# EAGLE design multisonar (EAGLE 8.3.0)
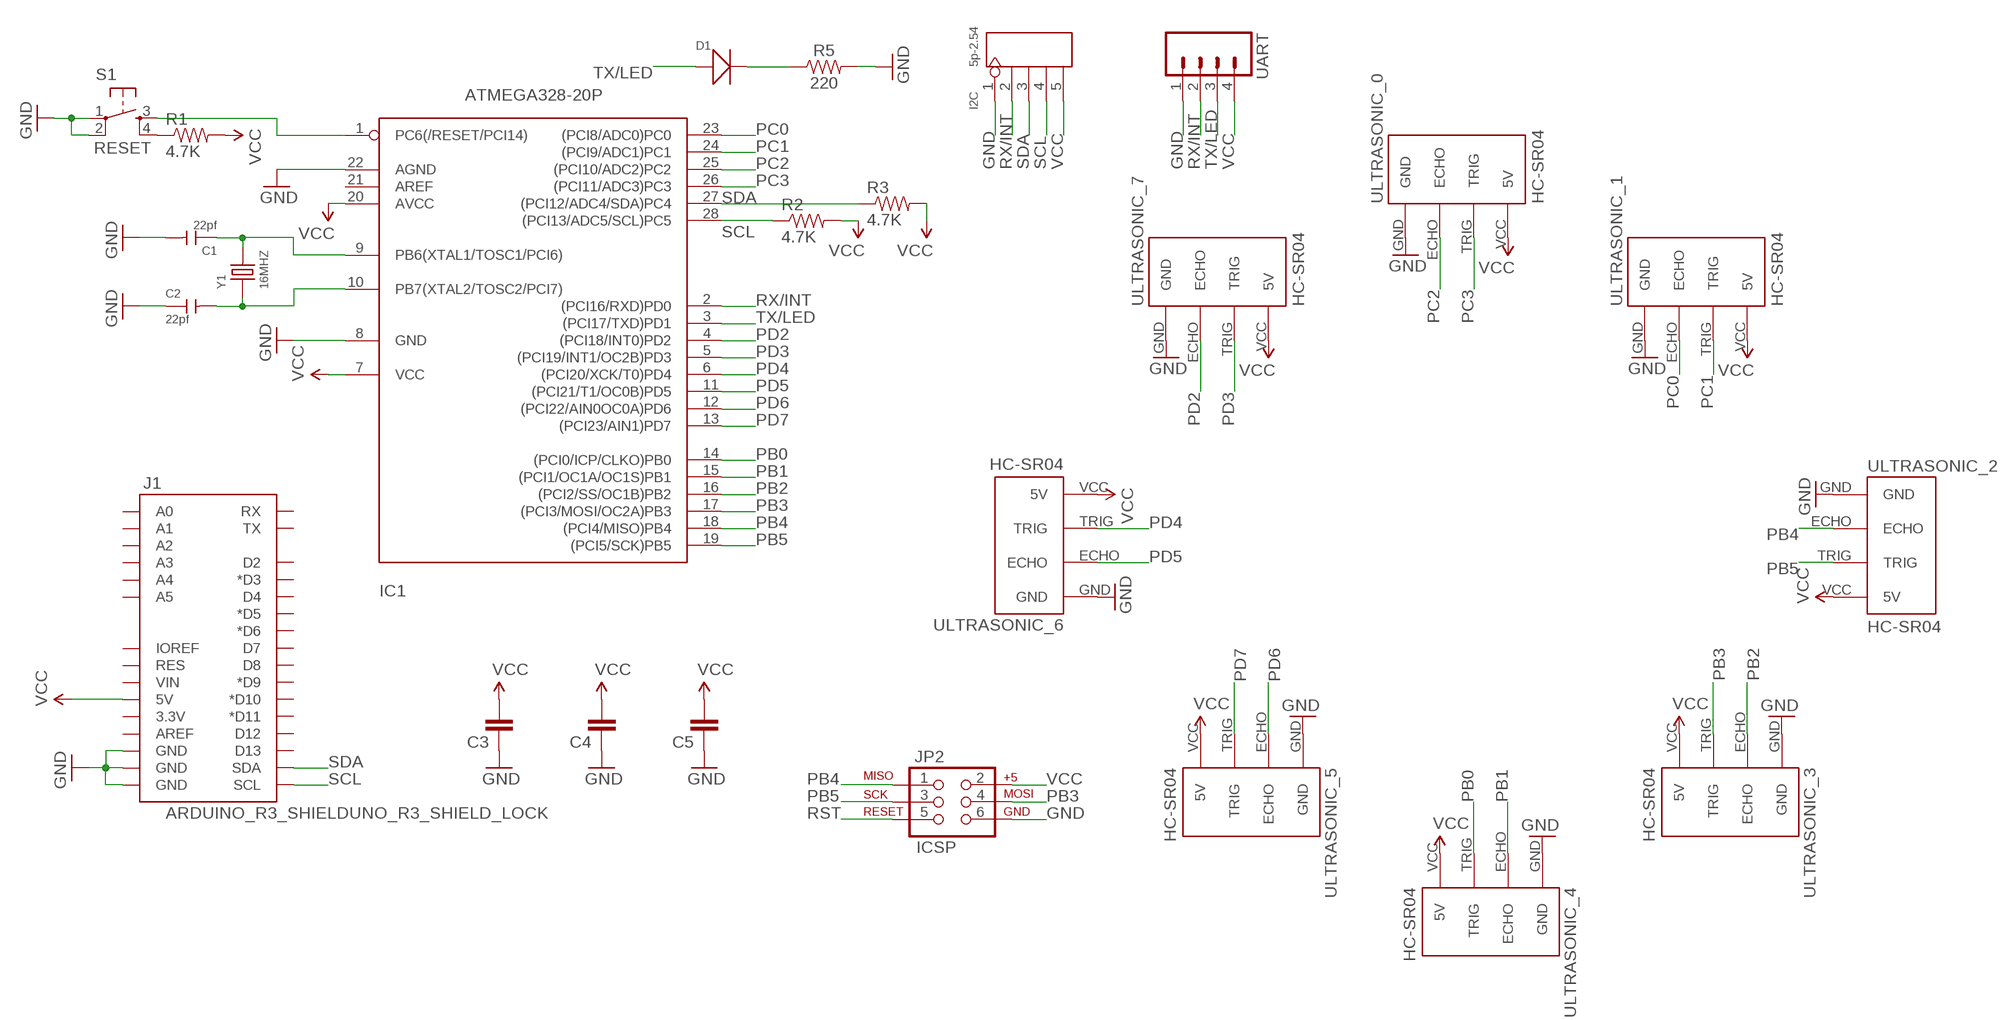
[diagram p0: schematic, sheet 1]

## Parts
C1  22pf  DIP-CERAMIC-22PF-100V-5%-NPO(D5.0MM)  [CERAMIC-2.54]
C2  22pf  DIP-CERAMIC-22PF-100V-5%-NPO(D5.0MM)  [CERAMIC-2.54]
C3  0.1UF-50V-20%(PTH)KIT-EZ  [CAP-PTH-SMALL-KIT]
C4  0.1UF-50V-20%(PTH)KIT-EZ  [CAP-PTH-SMALL-KIT]
C5  0.1UF-50V-20%(PTH)KIT-EZ  [CAP-PTH-SMALL-KIT]
D1  DIODE'1206'  [SOD-123]
I2C  5p-2.54  DIP-BLACK-FEMALE-HEADER-VERT(5P-2.54)  [H5-2.54]
IC1  ATMEGA328-20P  [DIL28-3]
J1  ARDUINO_R3_SHIELDUNO_R3_SHIELD_LOCK  [UNO_R3_SHIELD_LOCK]
JP2  ICSP  AVR_SPI_PRG_62X3_LOCK  [2X3_LOCK]
R1  4.7K  10KOHM-1/4W-1%(PTH)HORIZ-KIT  [AXIAL-0.3EZ]
R2  4.7K  10KOHM-1/4W-1%(PTH)HORIZ-KIT  [AXIAL-0.3EZ]
R3  4.7K  10KOHM-1/4W-1%(PTH)HORIZ-KIT  [AXIAL-0.3EZ]
R5  220  RESISTOR1206  [1206]
S1  RESET  TACTILE-SWITCH-PTH  [TAC-SWITCH-PTH]
UART  M04PTH  [1X04]
ULTRASONIC_0  HC-SR04  [HC-SR04_FOOTPRINT]
ULTRASONIC_1  HC-SR04  [HC-SR04_FOOTPRINT]
ULTRASONIC_2  HC-SR04  [HC-SR04_FOOTPRINT]
ULTRASONIC_3  HC-SR04  [HC-SR04_FOOTPRINT]
ULTRASONIC_4  HC-SR04  [HC-SR04_FOOTPRINT]
ULTRASONIC_5  HC-SR04  [HC-SR04_FOOTPRINT]
ULTRASONIC_6  HC-SR04  [HC-SR04_FOOTPRINT]
ULTRASONIC_7  HC-SR04  [HC-SR04_FOOTPRINT]
Y1  16MHZ  DIP-CRYSTAL-16MHZ-18PF-30PPM-40R(HC49US)  [HC49US]

## Nets
GND: C1.2 C2.1 C3.1 C4.1 C5.1 I2C.1 IC1.8(GND) IC1.22(AGND) J1.GND@0(GND) J1.GND@1(GND) J1.GND@2(GND) JP2.6 R5.2 S1.1 S1.2 UART.1 ULTRASONIC_0.GND ULTRASONIC_1.GND ULTRASONIC_2.GND ULTRASONIC_3.GND ULTRASONIC_4.GND ULTRASONIC_5.GND ULTRASONIC_6.GND ULTRASONIC_7.GND
N$1: R1.P$1 S1.4
N$2: D1.- R5.1
N$3: C1.1 IC1.9(PB6(XTAL1/TOSC1/PCI6)) Y1.2
N$4: C2.2 IC1.10(PB7(XTAL2/TOSC2/PCI7)) Y1.1
PB0: IC1.14((PCI0/ICP/CLKO)PB0) ULTRASONIC_4.TRIG
PB1: IC1.15((PCI1/OC1A/OC1S)PB1) ULTRASONIC_4.ECHO
PB2: IC1.16((PCI2/SS/OC1B)PB2) ULTRASONIC_3.ECHO
PB3: IC1.17((PCI3/MOSI/OC2A)PB3) JP2.4 ULTRASONIC_3.TRIG
PB4: IC1.18((PCI4/MISO)PB4) JP2.1 ULTRASONIC_2.ECHO
PB5: IC1.19((PCI5/SCK)PB5) JP2.3 ULTRASONIC_2.TRIG
PC0: IC1.23((PCI8/ADC0)PC0) ULTRASONIC_1.ECHO
PC1: IC1.24((PCI9/ADC1)PC1) ULTRASONIC_1.TRIG
PC2: IC1.25((PCI10/ADC2)PC2) ULTRASONIC_0.ECHO
PC3: IC1.26((PCI11/ADC3)PC3) ULTRASONIC_0.TRIG
PD2: IC1.4((PCI18/INT0)PD2) ULTRASONIC_7.ECHO
PD3: IC1.5((PCI19/INT1/OC2B)PD3) ULTRASONIC_7.TRIG
PD4: IC1.6((PCI20/XCK/T0)PD4) ULTRASONIC_6.TRIG
PD5: IC1.11((PCI21/T1/OC0B)PD5) ULTRASONIC_6.ECHO
PD6: IC1.12((PCI22/AIN0OC0A)PD6) ULTRASONIC_5.ECHO
PD7: IC1.13((PCI23/AIN1)PD7) ULTRASONIC_5.TRIG
RST: IC1.1(PC6(/RESET/PCI14)) JP2.5 S1.3
RX/INT: I2C.2 IC1.2((PCI16/RXD)PD0) UART.2
SCL: I2C.4 IC1.28((PCI13/ADC5/SCL)PC5) J1.SCL R2.P$1
SDA: I2C.3 IC1.27((PCI12/ADC4/SDA)PC4) J1.SDA R3.P$1
TX/LED: D1.+ IC1.3((PCI17/TXD)PD1) UART.3
VCC: C3.2 C4.2 C5.2 I2C.5 IC1.7(VCC) IC1.20(AVCC) J1.5V JP2.2 R1.P$2 R2.P$2 R3.P$2 UART.4 ULTRASONIC_0.VCC(5V) ULTRASONIC_1.VCC(5V) ULTRASONIC_2.VCC(5V) ULTRASONIC_3.VCC(5V) ULTRASONIC_4.VCC(5V) ULTRASONIC_5.VCC(5V) ULTRASONIC_6.VCC(5V) ULTRASONIC_7.VCC(5V)
Unconnected: IC1.21(AREF) J1.3.3V J1.A0 J1.A1 J1.A2 J1.A3 J1.A4 J1.A5 J1.AREF J1.D2 J1.D3(*D3) J1.D4 J1.D5(*D5) J1.D6(*D6) J1.D7 J1.D8 J1.D9(*D9) J1.D10(*D10) J1.D11(*D11) J1.D12 J1.D13 J1.IOREF J1.RES J1.RX J1.TX J1.VIN

## Library data of the parts
C1 C2 = Seeed-OPL-Capacitor:DIP-CERAMIC-22PF-100V-5%-NPO(D5.0MM): 302010197; MPN: CT4-0805CG220J101F3
C3-C5 = SparkFun-Capacitors:0.1UF-50V-20%(PTH): CAP-08370; PROD_ID: CAP-08370
D1 = Seeed-OPL-Diode:DIODE*
I2C = Seeed-OPL-Connector:DIP-BLACK-FEMALE-HEADER-VERT(5P-2.54): 320030028; MPN: F185-1105A0BSYA1
IC1 = atmega328:ATMEGA328*P: MICROCONTROLLER 32 kBytes FLASH 2 kBytes SRAM 1 kBytes EEPROM USART 8-channel 10 bit ADC
J1 = SparkFun-Boards:ARDUINO_R3_SHIELD: Shield form compatible with the Arduino Uno R3.
JP2 = SparkFun-Connectors:AVR_SPI_PRG_6: AVR ISP 6 Pin This is the reduced ISP connector for AVR programming. Common on Arduino. This footprint will take up less PCB space and can be used with a 10-pin to 6-pin adapter such as SKU: BOB-08508 **Special note about "TEST_POINT" package. The stop mask is on the top side, so if you want your programming test points to be on the bottom of your board, make sure to place this package on the bottom side of the board. This also ensure that the orientation to program from the bottom side will be correct.
R1-R3 = SparkFun-Resistors:10KOHM-1/4W-1%(PTH): RES-12183; PROD_ID: RES-12183; VALUE: 10k
R5 = SparkFun-Resistors:RESISTOR: Generic Resistor Package
S1 = GeekAmmo:TACTILE-SWITCH: Tactile Switch 4 Pins, SPST NO
UART = SparkFun-Connectors:M04: Header 4 Standard 4-pin 0.1" header. Use with straight break away headers (SKU : PRT-00116), right angle break away headers (PRT-00553), swiss pins (PRT-00743), machine pins (PRT-00117), and female headers (PRT-00115). Molex polarized connector foot print use with SKU : PRT-08231 with associated crimp pins and housings. 1MM SMD Version SKU: PRT-10208
ULTRASONIC_0 ULTRASONIC_1-ULTRASONIC_7 = Ultrasonic Sensor HC-SR04:HC-SR04: Ultrasonic Sensor HC-SR04
Y1 = Seeed-OPL-Crystal-Oscillator:DIP-CRYSTAL-16MHZ-18PF-30PPM-40R(HC49US): 306010014; MPN: HC-49US 16.000MHz

## Board
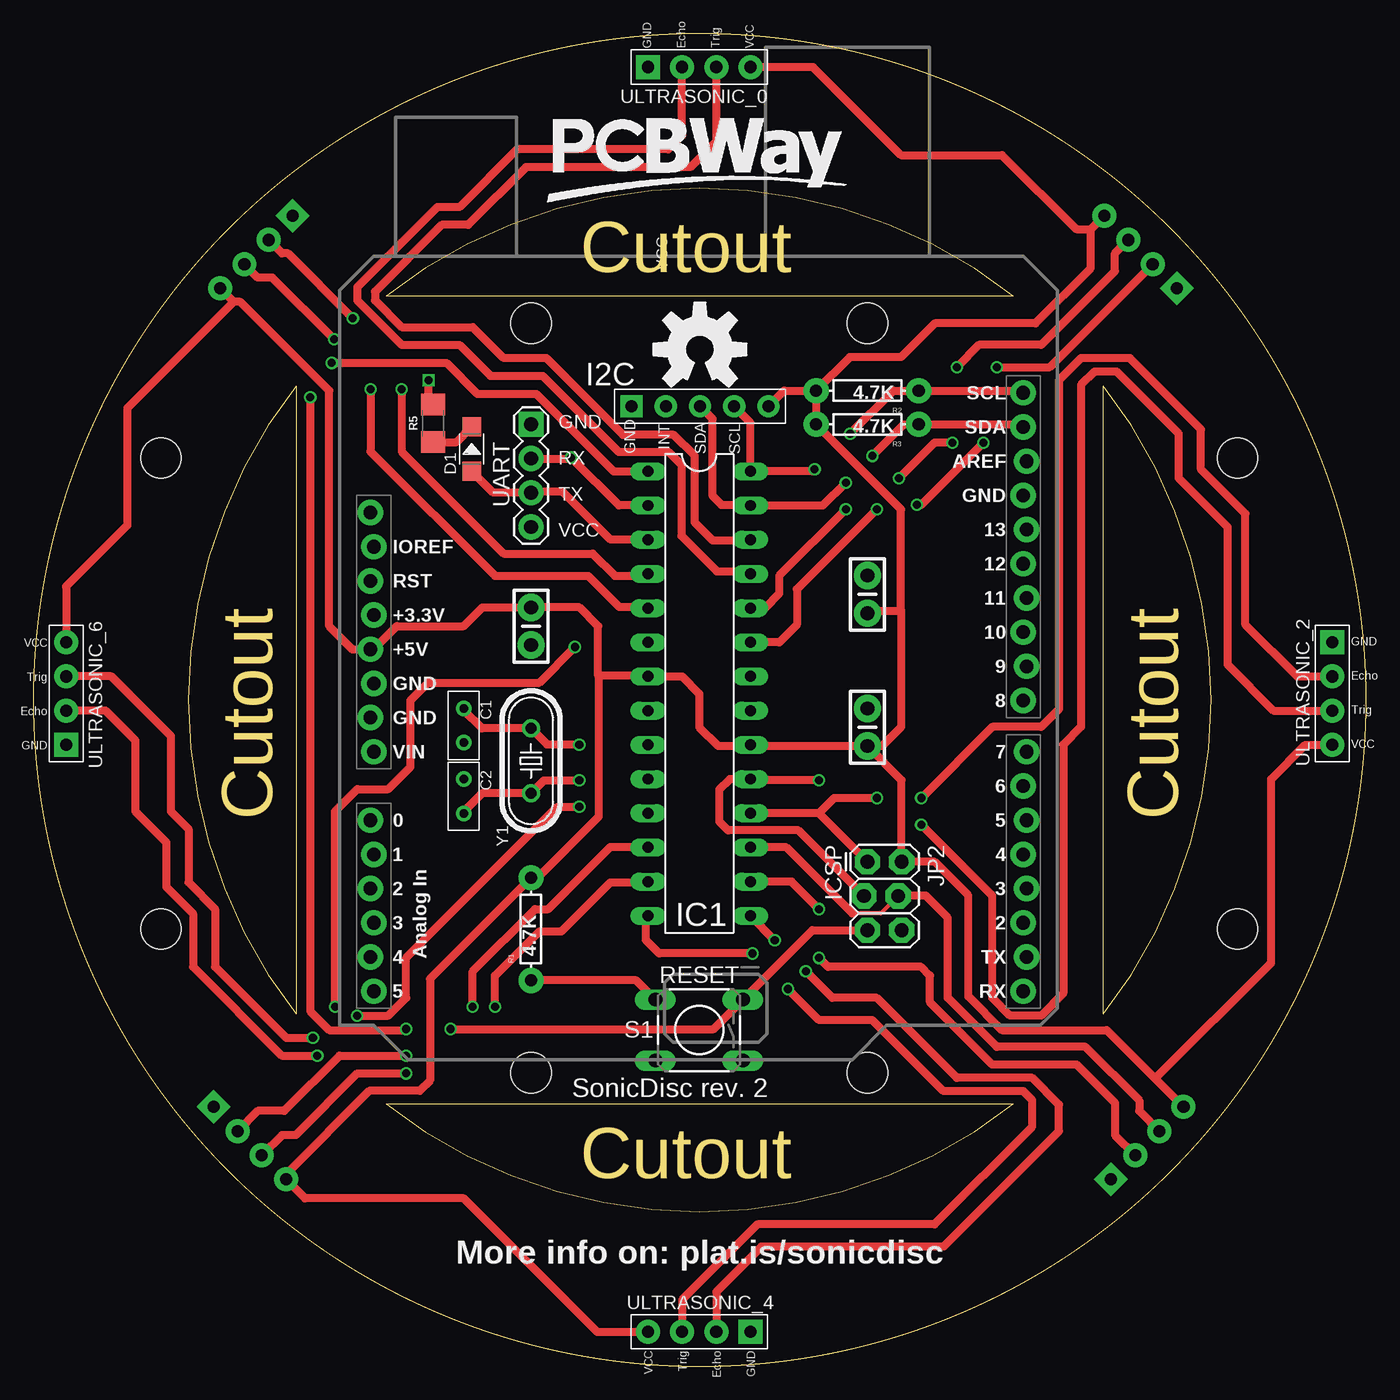
[diagram p1: board, top side]
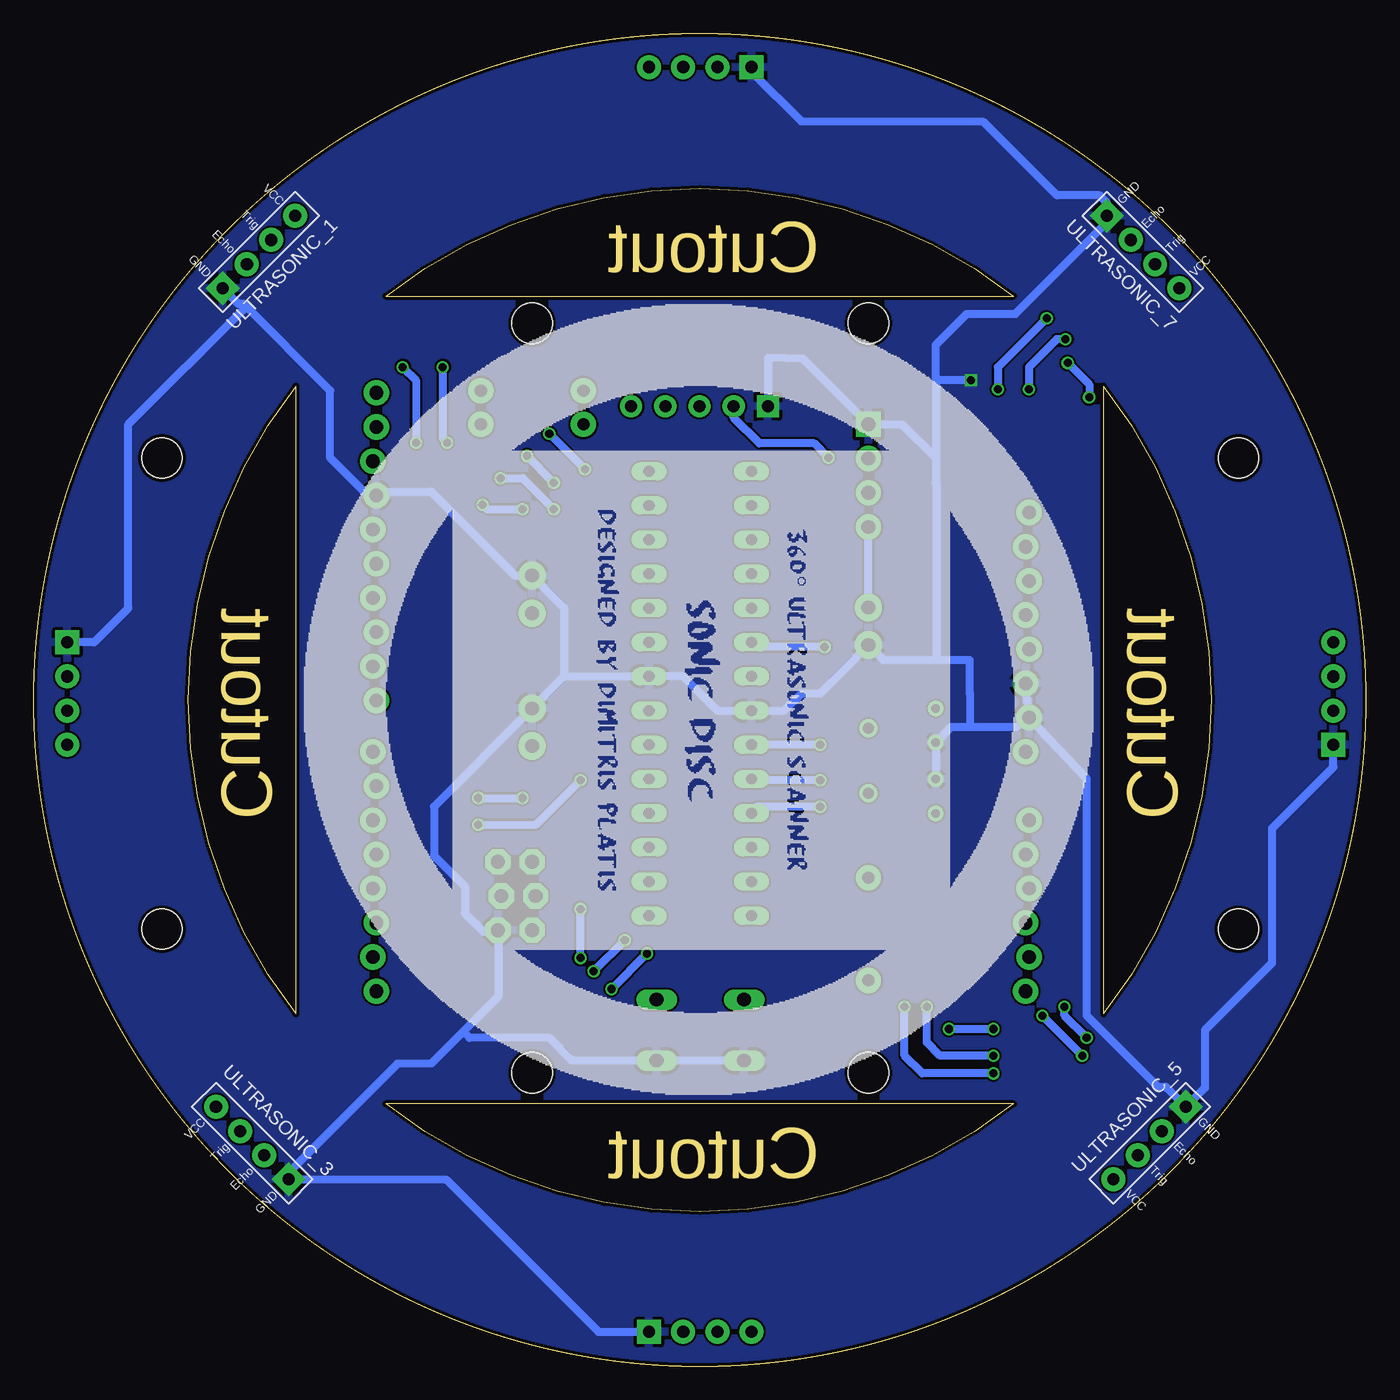
[diagram p2: board, bottom side, seen from below]

Size 99 x 99 mm. Coordinates in mm from the lower left corner, seen from the top.
Outline: 19.5,72.82 arc76 19.5,26.18 19.5,72.82
Outline: 26.18,19.5 72.82,19.5 arc-76 26.18,19.5
Outline: 79.5,26.18 79.5,72.82 arc-76 79.5,26.18
Outline: 72.82,79.5 arc76 26.18,79.5 72.82,79.5
Outline: circle at 49.5,49.5 radius 49.5
Copper layers (1*16): Top 0.035mm / dielectric 1.5mm / Bottom 0.035mm
Design rules "SeeedStudio_2layer_DRU_edited": minimum track width 7mil, minimum drill 15mil, track to track 6mil, track to pad 6mil, pad to pad 6mil, via to via 6mil, smd to smd 0mil, copper to edge 10mil, drill to drill 10mil, minimum pad ring 10mil, minimum via ring 6mil, stop-mask expansion 2mil, vias tented up to drill 100mil, thermal gap 10mil
Holes 3 mm at 36.96,77.48 36.96,21.81 61.96,21.81 61.96,77.48 9.46,32.48 89.46,32.48 89.46,67.48 9.46,67.48
Milling: 8 lines

### Footprints (pad centres in the part's own frame; a part is rotated, then mirrored left to right if it is on the bottom)
CERAMIC-2.54 = drill 0.635 pad 1.143: 1 -1.27,0; 2 1.27,0
CAP-PTH-SMALL-KIT = drill 1.016 pad 2.032: 1 -1.397,0; 2 1.397,0
SOD-123 = smd 1.397 x 1.397: + -1.651,0; - 1.651,0
H5-2.54 = drill 0.889 pad 1.651 square: 1 0,5.08 | drill 0.889 pad 1.651: 2 0,2.54; 3 0,0; 4 0,-2.54; 5 0,-5.08
DIL28-3 = drill 0.813 long: 1 -16.51,-3.81; 2 -13.97,-3.81; 3 -11.43,-3.81; 4 -8.89,-3.81; 5 -6.35,-3.81; 6 -3.81,-3.81; 7 -1.27,-3.81; 8 1.27,-3.81; 9 3.81,-3.81; 10 6.35,-3.81; 11 8.89,-3.81; 12 11.43,-3.81; 13 13.97,-3.81; 14 16.51,-3.81; 15 16.51,3.81; 16 13.97,3.81; 17 11.43,3.81; 18 8.89,3.81; 19 6.35,3.81; 20 3.81,3.81; 21 1.27,3.81; 22 -1.27,3.81; 23 -3.81,3.81; 24 -6.35,3.81; 25 -8.89,3.81; 26 -11.43,3.81; 27 -13.97,3.81; 28 -16.51,3.81
UNO_R3_SHIELD_LOCK = drill 1.016 pad 1.88: 3.3V 50.8,26.67; 5V 51.054,29.21; A0 51.054,41.91; A1 50.8,44.45; A2 51.054,46.99; A3 50.8,49.53; A4 51.054,52.07; A5 50.8,54.61; AREF 2.286,15.24; D2 2.54,49.53; D3 2.286,46.99; D4 2.54,44.45; D5 2.286,41.91; D6 2.54,39.37; D7 2.286,36.83; D8 2.54,33.02; D9 2.286,30.48; D10 2.54,27.94; D11 2.286,25.4; D12 2.54,22.86; D13 2.286,20.32; GND@0 50.8,31.75; GND@1 51.054,34.29; GND@2 2.54,17.78; IOREF 50.8,21.59; NC 51.054,19.05; RES 51.054,24.13; RX 2.54,54.61; SCL 2.54,10.16; SDA 2.54,12.7; TX 2.286,52.07; VIN 50.8,36.83
2X3_LOCK = drill 1.016 pad 1.88 octagon: 1 0,0; 2 0,2.54; 3 2.54,-0.254; 4 2.54,2.286; 5 5.08,0; 6 5.08,2.54
AXIAL-0.3EZ = drill 0.9 pad 1.88: P$1 -3.81,0; P$2 3.81,0
1206 = smd 1.6 x 1.8: 1 -1.4,0; 2 1.4,0
TAC-SWITCH-PTH = drill 1.016 pad 1.524 long: 1 -3.251,2.261; 2 3.251,2.261; 3 -3.251,-2.261; 4 3.251,-2.261
1X04 = drill 1.016 pad 1.88 square: 1 0,0 | drill 1.016 pad 1.88: 2 2.54,0; 3 5.08,0; 4 7.62,0
HC-SR04_FOOTPRINT = drill 0.9 pad 1.778: ECHO 2.54,1.27; TRIG 2.54,-1.27; VCC 2.54,-3.81 | drill 0.9 pad 1.778 square: GND 2.54,3.81
HC49US = drill 0.813: 1 -2.413,0; 2 2.413,0

### Placement (x,y rotation side)
C1  31.96,47.61 270 top
C2  31.96,42.35 270 top
C3  36.96,54.98 90 top
C4  61.96,47.48 270 top
C5  61.96,57.34 270 top
D1  32.56,68.14 90 top
I2C  49.52,71.32 90 top
IC1  49.46,49.98 270 top
J1  76.08,82.48 180 top
JP2  61.96,37.48 270 top
R1  36.96,32.48 90 top
R2  61.96,72.48 180 top
R3  61.96,69.98 180 top
R5  29.68,70.06 90 top
S1  49.46,24.98 180 top
U$1  [OSHW-LOGO-L]  49.51,75.54 0 top
UART  36.96,69.98 270 top
ULTRASONIC_0  49.46,93.98 90 top
ULTRASONIC_1  80.46,80.98 135 bottom
ULTRASONIC_2  93.96,49.98 0 top
ULTRASONIC_3  80.96,18.38 225 bottom
ULTRASONIC_4  49.46,5.1 270 top
ULTRASONIC_5  17.86,18.38 315 bottom
ULTRASONIC_6  4.96,49.98 180 top
ULTRASONIC_7  18.36,80.98 45 bottom
Y1  36.96,44.98 90 top

### Tracks (layer width: path | path; a pad name or v marks a point on that pad's centre or on a via)
GND  (via drill 0.6)
  Top 0.61: R5.2 29.36,71.78 v29.36,73.26
  Bottom 0.61: 67.07,24.87 69.46,22.48 71.96,22.48 80.06,14.38 ULTRASONIC_3.GND 68.37,13.89 57.04,2.56 ULTRASONIC_4.GND | 67.07,24.87 64.46,27.48 64.46,32.27 | 64.46,32.27 64.46,32.48 | J1.GND@1 J1.GND@0 | J1.GND@1 25.99,47.48 29.42,47.48 | 31.89,52.48 35.86,52.48 C3.1 40.56,49.98 41.96,49.98 43.23,48.71 IC1.8 48.19,48.71 50.73,51.25 IC1.22 59.59,51.25 | 31.89,52.48 29.46,52.48 29.46,49.98 29.42,49.94 29.42,47.48 | 59.59,51.25 C4.1 69.26,41.58 69.26,37.93 66.95,35.62 66.95,33.64 65.58,32.27 64.46,32.27 | 31.96,67.48 34.46,69.98 UART.1 41.84,74.86 44.43,74.91 I2C.1 | 31.96,52.55 31.92,52.51 | 31.96,73.48 31.96,75.89 29.66,78.19 26.03,78.19 18.75,85.47 ULTRASONIC_7.GND 19.25,86.44 19.79,86.98 | 31.96,73.48 31.96,67.48 | 59.59,51.25 59.59,56.36 C5.1 63.22,58.74 69.46,64.98 73.26,64.98 J1.GND@2 73.82,64.98 74.46,64.98 76.96,67.48 76.96,72.48 83.4,78.92 | J1.GND@1 20.75,43.66 20.75,26.05 15.47,20.77 14.87,20.77 ULTRASONIC_5.GND 11.96,20.68 11.96,24.98 6.96,29.98 6.96,39.98 2.42,44.52 ULTRASONIC_6.GND | 67.07,24.87 66.61,24.4 60.68,24.4 59,22.72 S1.1 S1.2 | 31.89,52.48 31.92,52.51 | 31.92,52.51 31.92,65.58 31.96,65.62 31.96,67.48 | v29.36,73.26 31.74,73.26 31.96,73.48 | 29.42,47.48 30.82,47.48 C1.2 C2.1 | ULTRASONIC_0.GND 45.65,96.17 41.96,92.48 28.46,92.48 22.96,86.98 19.79,86.98 | ULTRASONIC_2.GND 94.5,53.79 91.96,56.33 91.96,69.98 83.4,78.54 83.4,78.92 | 19.79,86.98 19.76,86.98 | 83.4,78.92 83.79,78.92 ULTRASONIC_1.GND
  pour Bottom: -0.54,99.98 99.46,99.98 99.46,-1.02 -0.54,-1.02
N$1
  Top 0.61: S1.4 44.78,28.67 R1.P$1
N$2
  Top 0.61: R5.1 31.43,68.66 D1.-
N$3  (via drill 0.6)
  Top 0.61: v40.55,46.18 arc90 40.52,46.21 38.14,46.21 Y1.2 33.32,47.39 31.96,48.75 C1.1
  Bottom 0.61: v40.55,46.18 IC1.9 arc-90 IC1.9
N$4  (via drill 0.6)
  Top 0.61: v40.55,43.54 arc-90 v40.54,43.53 37.92,43.53 Y1.1 33.32,42.57 31.96,41.21 C2.2
  Bottom 0.61: v40.55,43.54 45.56,43.54 arc90 IC1.10
PB0  (via drill 0.6)
  Top 0.61: v56.06,28.03 58.37,25.72 62.33,25.72 67.61,20.44 73.55,20.44 74.21,19.78 74.21,17.8 66.95,10.54 53.79,10.54 48.19,4.94 ULTRASONIC_4.TRIG | v53.42,30.67 46.49,30.67 45.5,31.66 45.5,33.32 IC1.14
  Bottom 0.61: v56.06,28.03 v53.42,30.67
PB1  (via drill 0.6)
  Top 0.61: v57.38,29.35 59.36,27.37 62.66,27.37 68.6,21.43 74.21,21.43 76.19,19.45 76.19,17.47 67.61,8.89 54.08,8.89 50.73,5.54 ULTRASONIC_4.ECHO | v55.07,31.66 v55.07,31.67 IC1.15
  Bottom 0.61: v57.38,29.35 v55.07,31.66
PB2  (via drill 0.6)
  Top 0.61: v58.37,30.34 59.03,29.68 65.96,29.68 66.62,29.02 66.62,27.04 71.24,22.42 77.51,22.42 80.36,19.57 80.36,17.18 ULTRASONIC_3.ECHO | v58.37,33.97 56.33,36.01 IC1.16
  Bottom 0.61: v58.37,30.34 v58.37,33.97
PB3
  Top 0.305: JP2.4 62.96,33.65 60.83,33.65
  Top 0.61: 60.83,33.65 55.93,38.55 IC1.17 | JP2.4 64.27,34.96 66.29,34.96 67.94,33.31 67.94,27.37 71.57,23.74 78.17,23.74 82.15,19.76 82.15,18.98 ULTRASONIC_3.TRIG
PB4  (via drill 0.6)
  Top 0.61: 58.35,41.09 JP2.1 | 58.35,41.09 IC1.18 | v62.66,42.22 59.48,42.22 58.35,41.09 | v65.96,42.22 71.24,47.5 74.87,47.5 76.19,48.82 76.19,73.24 77.84,74.89 81.47,74.89 86.75,69.61 86.75,66.64 90.05,63.34 90.05,55.09 93.89,51.25 ULTRASONIC_2.ECHO
  Bottom 0.61: v65.96,42.22 v62.66,42.22
PB5  (via drill 0.6)
  Top 0.61: JP2.3 56.83,39.82 51.6,39.82 50.96,40.46 50.96,42.86 51.73,43.63 IC1.19 53.36,43.54 v58.37,43.54 | v65.96,40.24 71.24,34.96 71.24,27.37 72.56,26.05 74.87,26.05 76.52,27.7 76.52,46.18 77.84,47.5 77.84,72.91 78.83,73.9 80.48,73.9 85.1,69.28 85.1,65.98 88.73,62.35 88.73,52.12 92.14,48.71 ULTRASONIC_2.TRIG
  Bottom 0.61: v65.96,40.24 61.67,40.24 v58.37,43.54
PC0  (via drill 0.6)
  Top 0.61: v71.57,74.23 75.51,74.23 ULTRASONIC_1.ECHO | v70.58,68.62 65.96,64 v65.63,64 | v62.66,63.67 56.72,57.73 56.72,55.09 55.42,53.79 IC1.23
  Bottom 0.61: v71.57,74.23 70.58,73.24 v70.58,68.62 | v65.63,64 65.3,63.67 v62.66,63.67
PC1  (via drill 0.6)
  Top 0.61: v68.6,74.23 70.25,75.88 74.87,75.88 80.36,81.37 80.36,82.67 ULTRASONIC_1.TRIG | v68.27,68.62 66.95,68.62 v64.31,65.98 | IC1.24 54.33,56.33 55.4,57.4 55.4,58.72 v60.35,63.67
  Bottom 0.61: v68.6,74.23 68.6,68.95 v68.27,68.62 | v64.31,65.98 62.66,65.98 v60.35,63.67
PC2
  Top 0.61: IC1.25 53.09,59.05 50.78,59.05 48.14,61.69 48.14,66.97 47.18,67.92 43.47,67.92 37.83,73.57 33.95,73.57 31.64,75.88 27.35,75.88 24.05,79.18 24.05,80.17 29.99,86.11 31.64,86.11 35.93,90.4 47.15,90.4 48.19,91.44 ULTRASONIC_0.ECHO
PC3
  Top 0.61: IC1.26 53.22,61.36 50.45,61.36 49.13,62.68 49.13,67.63 47.56,69.19 43.79,69.19 38.1,74.89 34.94,74.89 32.63,77.2 27.35,77.2 25.37,79.18 25.37,79.84 30.32,84.79 32.3,84.79 36.59,89.08 48.8,89.08 50.73,91.01 ULTRASONIC_0.TRIG
PD2  (via drill 0.6)
  Top 0.61: v23.72,77.86 18.91,82.67 18.46,82.67 ULTRASONIC_7.ECHO | v27.35,72.58 27.35,67.96 34.94,60.37 41.54,60.37 43.19,58.72 45.5,58.72 IC1.4
  Bottom 0.61: v23.72,77.86 27.35,74.23 v27.35,72.58
PD3  (via drill 0.6)
  Top 0.61: v25.04,72.58 25.04,67.96 34.28,58.72 41.21,58.72 43.52,56.41 45.57,56.41 IC1.5 | v22.32,76.3 17.74,80.88 16.66,80.88 ULTRASONIC_7.TRIG
  Bottom 0.61: v25.04,72.58 25.04,74.23 22.97,76.3 v22.32,76.3
PD4  (via drill 0.6)
  Top 0.61: v20.75,24.4 18.77,24.4 13.49,29.68 13.49,33.97 11.51,35.95 11.51,39.91 10.19,41.23 10.19,46.84 5.78,51.25 ULTRASONIC_6.TRIG | v22.4,26.71 22.4,41.23 24.05,42.88 26.36,42.88 28.01,44.53 28.01,49.48 29.33,50.8 37.58,50.8 v40.22,53.44
  Bottom 0.61: v20.75,24.4 22.4,26.05 v22.4,26.71 | v40.22,53.44 45.3,53.44 IC1.6
PD5  (via drill 0.6)
  Top 0.61: v21.08,23.08 18.44,23.08 11.84,29.68 11.84,33.64 9.86,35.62 9.86,38.92 7.55,41.23 7.55,46.51 5.35,48.71 ULTRASONIC_6.ECHO | v40.55,41.56 38.9,41.56 27.68,30.34 27.68,27.37 26.36,26.05 v24.05,26.05
  Bottom 0.61: v40.55,41.56 45.18,41.56 arc-90 IC1.11 | v21.08,23.08 v24.05,26.05
PD6  (via drill 0.6)
  Top 0.61: v27.68,23.08 22.73,23.08 18.63,18.98 16.66,18.98 ULTRASONIC_5.ECHO | v32.63,26.71 32.63,29.35 37.25,33.97 38.24,33.97 42.86,38.59 45.61,38.59 IC1.12
  Bottom 0.61: v32.63,26.71 32.63,24.07 31.64,23.08 v27.68,23.08
PD7  (via drill 0.6)
  Top 0.61: v34.28,26.71 34.28,29.02 37.58,32.32 39.23,32.32 42.86,35.95 45.59,35.95 IC1.13 | v27.68,21.76 24.05,21.76 19.47,17.18 18.46,17.18 ULTRASONIC_5.TRIG
  Bottom 0.61: v34.28,26.71 34.28,23.08 32.96,21.76 v27.68,21.76
RST  (via drill 0.6)
  Top 0.61: JP2.5 57.87,32.4 S1.3 50.53,25.06 v30.98,25.06 | v20.56,71.98 20.56,26.38 21.96,24.98 27.6,24.98 v27.68,25.06 | v22.16,74.54 30.67,74.54 32.96,72.25 37.35,72.25 43.11,66.49 IC1.1
  Bottom 0.61: v22.16,74.54 20.56,72.94 v20.56,71.98 | v27.68,25.06 v30.98,25.06
RX/INT  (via drill 0.6)
  Top 0.61: IC1.2 43.49,63.95 v39.93,67.51 39.86,67.44 UART.2
  Bottom 0.61: v39.93,67.51 40.98,68.56 45.06,68.56 46.98,70.47 I2C.2
SCL  (via drill 0.6)
  Top 0.61: v58.04,66.64 57.89,66.49 IC1.28 53.27,70.11 I2C.4 | v60.68,69.28 63.88,72.48 R2.P$1 73.38,72.48 J1.SCL
  Bottom 0.61: v58.04,66.64 v60.68,69.28
SDA  (via drill 0.6)
  Top 0.61: v60.35,65.65 58.65,63.95 IC1.27 53.22,64 51.11,64 50.45,64.66 50.45,70.39 I2C.3 | v62.33,67.63 64.68,69.98 R3.P$1 73.34,69.98 J1.SDA
  Bottom 0.61: v60.35,65.65 v62.33,67.63
TX/LED
  Top 0.61: IC1.3 42.88,61.41 39.32,64.97 37.03,64.97 UART.3 34.15,64.9 D1.+
VCC
  Top 0.61: 83.33,21.39 79.74,24.98 71.96,24.98 69.46,27.48 69.46,34.98 66.96,37.48 JP2.2 64.5,43.54 C4.2 | 53.36,46.08 C4.2 | 53.36,46.08 IC1.20 | C4.2 63.06,46.08 64.46,47.48 64.46,56.14 | 41.96,51.29 41.96,54.98 40.56,56.38 C3.2 33.36,56.38 31.96,54.98 26.99,54.98 25.28,53.27 J1.5V 23.67,53.27 21.96,54.98 21.96,72.48 15.36,79.08 14.87,79.08 | 41.96,51.29 45.61,51.29 IC1.7 48.19,51.25 49.46,49.98 49.46,47.48 50.86,46.08 53.36,46.08 | 83.33,21.39 83.37,21.39 91.96,29.98 91.96,43.63 94.5,46.17 ULTRASONIC_2.VCC | 41.96,51.29 42,51.25 42,40.85 37.44,36.29 R1.P$2 29.46,28.79 29.46,21.23 28.69,20.46 24.94,20.46 18.75,14.27 ULTRASONIC_5.VCC 20.16,12.48 31.96,12.48 41.88,2.56 ULTRASONIC_4.VCC | 64.46,56.14 64.46,63.67 R3.P$2 R2.P$2 | C5.2 62.16,56.14 64.46,56.14 | R2.P$2 60.65,74.98 64.46,74.98 66.96,77.48 74.46,77.48 78.56,81.58 78.56,84.47 | ULTRASONIC_0.VCC 57.92,96.52 64.46,89.98 71.96,89.98 77.47,84.47 78.56,84.47 | 83.33,21.39 ULTRASONIC_3.VCC | 14.87,79.08 6.96,71.18 6.96,62.48 2.42,57.94 ULTRASONIC_6.VCC | 78.56,84.47 ULTRASONIC_1.VCC | 14.87,79.08 ULTRASONIC_7.VCC | I2C.5 55.76,72.48 R2.P$2
  Bottom 0.61: C3.2 UART.4

### Text on the board
Dimension: Cutout | Cutout | Cutout | Cutout
tPlace: VCC | GND | GND | INT | SDA | SCL | RX | TX | VCC | SonicDisc rev. 2 | More info on: plat.is/sonicdisc